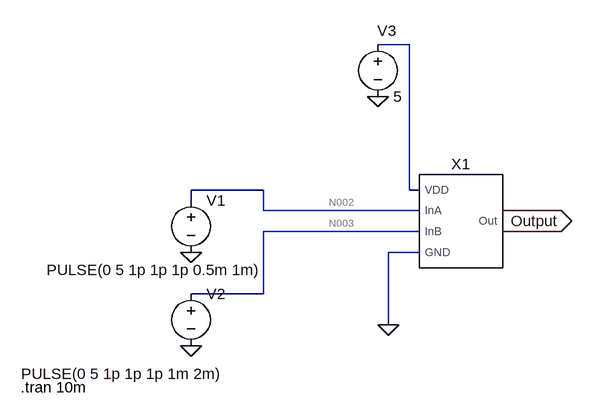
[diagram p0: schematic NAND test.asc]
NAND test.asc, the LTspice schematic file:
Version 4
SHEET 1 880 680
WIRE 160 -96 112 -96
WIRE -64 128 -176 128
WIRE 160 128 160 -96
WIRE 176 128 160 128
WIRE -176 144 -176 128
WIRE -64 160 -64 128
WIRE 176 160 -64 160
WIRE 176 192 -64 192
WIRE 176 224 128 224
WIRE -64 288 -64 192
WIRE -64 288 -176 288
WIRE 128 336 128 224
FLAG -176 224 0
FLAG -176 368 0
FLAG 128 336 0
FLAG 112 -16 0
FLAG 304 176 Output
IOPIN 304 176 Out
SYMBOL NAND 240 176 R0
SYMATTR InstName X1
SYMBOL voltage -176 128 R0
WINDOW 123 0 0 Left 0
WINDOW 39 0 0 Left 0
WINDOW 3 -222 123 Left 2
SYMATTR InstName V1
SYMATTR Value PULSE(0 5 1p 1p 1p 0.5m 1m)
SYMBOL voltage -176 272 R0
WINDOW 123 0 0 Left 0
WINDOW 39 0 0 Left 0
WINDOW 3 -261 139 Left 2
SYMATTR InstName V2
SYMATTR Value PULSE(0 5 1p 1p 1p 1m 2m)
SYMBOL voltage 112 -112 R0
WINDOW 123 0 0 Left 0
WINDOW 39 0 0 Left 0
WINDOW 0 -1 -5 Left 2
SYMATTR InstName V3
SYMATTR Value 5
TEXT -438 432 Left 2 !.tran 10m

The netlist it stands for:
* NAND test.asc
XX1 0 N002 N003 N001 Output NAND  ; pins GND InA InB VDD Out
V1 N002 0 PULSE(0 5 1p 1p 1p 0.5m 1m)
V2 N003 0 PULSE(0 5 1p 1p 1p 1m 2m)
V3 N001 0 5
.tran 10m
.backanno
.end

* Results of the author's LTspice run, read from the files saved beside the schematic
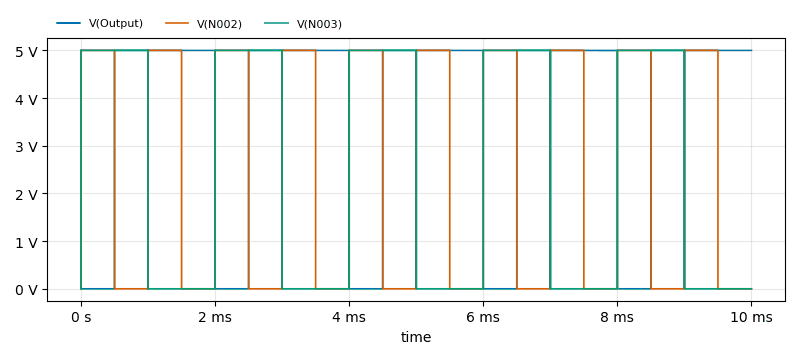
[diagram p1: Transient Analysis of NAND test.asc, plotted from the saved traces]
* Transient Analysis, 1 run:
*   V(Output): min 0 V, max 5 V, average 3.75 V, rms 4.33 V, last 5 V
*   V(N002): min 0 V, max 5 V, average 2.5 V, rms 3.536 V, last 0 V
*   V(N003): min 0 V, max 5 V, average 2.5 V, rms 3.536 V, last 0 V